# Altium project EIT_Teensybasedv1.PrjPcb (part 2 of 3)

## Sheet EIT_Teensy_Mux.SchDoc: EIT_Teensy
size A4 portrait
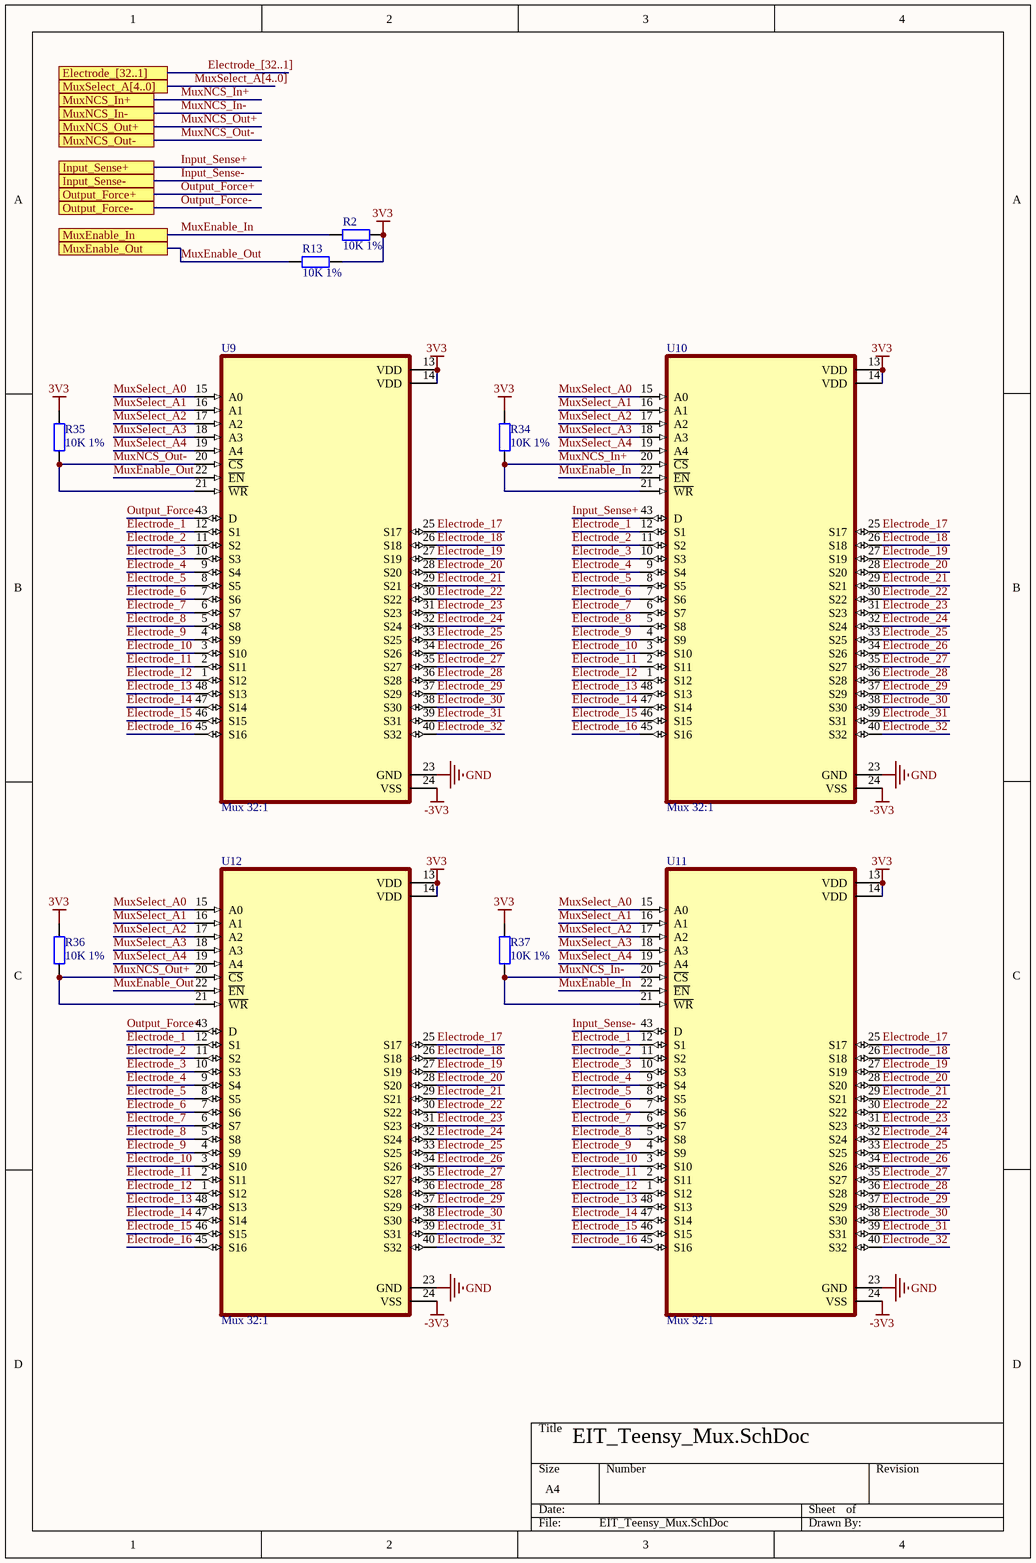
[diagram p4: EIT_Teensy_Mux.SchDoc]

### Parts
R2  10K 1%  [0603 RES]
R13  10K 1%  [0603 RES]
R34  10K 1%  [0603 RES]
R35  10K 1%  [0603 RES]
R36  10K 1%  [0603 RES]
R37  10K 1%  [0603 RES]
U9  Mux 32:1  [QFP50P900X900X120-49N]
U10  Mux 32:1  [QFP50P900X900X120-49N]
U11  Mux 32:1  [QFP50P900X900X120-49N]
U12  Mux 32:1  [QFP50P900X900X120-49N]

### Ports
Electrode_[32..1], Input_Sense+, Input_Sense-, MuxEnable_In, MuxEnable_Out, MuxNCS_In+, MuxNCS_In-, MuxNCS_Out+, MuxNCS_Out-, MuxSelect_A[4..0], Output_Force+, Output_Force-

### Nets
3V3: R2.2 R13.2 R34.2 R35.2 R36.2 R37.2 U9.13(VDD) U9.14(VDD) U10.13(VDD) U10.14(VDD) U11.13(VDD) U11.14(VDD) U12.13(VDD) U12.14(VDD)
-3V3: U9.24(VSS) U10.24(VSS) U11.24(VSS) U12.24(VSS)
GND: U9.23(GND) U10.23(GND) U11.23(GND) U12.23(GND)
Electrode_1: U9.12(S1) U10.12(S1) U11.12(S1) U12.12(S1)
Electrode_2: U9.11(S2) U10.11(S2) U11.11(S2) U12.11(S2)
Electrode_3: U9.10(S3) U10.10(S3) U11.10(S3) U12.10(S3)
Electrode_4: U9.9(S4) U10.9(S4) U11.9(S4) U12.9(S4)
Electrode_5: U9.8(S5) U10.8(S5) U11.8(S5) U12.8(S5)
Electrode_6: U9.7(S6) U10.7(S6) U11.7(S6) U12.7(S6)
Electrode_7: U9.6(S7) U10.6(S7) U11.6(S7) U12.6(S7)
Electrode_8: U9.5(S8) U10.5(S8) U11.5(S8) U12.5(S8)
Electrode_9: U9.4(S9) U10.4(S9) U11.4(S9) U12.4(S9)
Electrode_10: U9.3(S10) U10.3(S10) U11.3(S10) U12.3(S10)
Electrode_11: U9.2(S11) U10.2(S11) U11.2(S11) U12.2(S11)
Electrode_12: U9.1(S12) U10.1(S12) U11.1(S12) U12.1(S12)
Electrode_13: U9.48(S13) U10.48(S13) U11.48(S13) U12.48(S13)
Electrode_14: U9.47(S14) U10.47(S14) U11.47(S14) U12.47(S14)
Electrode_15: U9.46(S15) U10.46(S15) U11.46(S15) U12.46(S15)
Electrode_16: U9.45(S16) U10.45(S16) U11.45(S16) U12.45(S16)
Electrode_17: U9.25(S17) U10.25(S17) U11.25(S17) U12.25(S17)
Electrode_18: U9.26(S18) U10.26(S18) U11.26(S18) U12.26(S18)
Electrode_19: U9.27(S19) U10.27(S19) U11.27(S19) U12.27(S19)
Electrode_20: U9.28(S20) U10.28(S20) U11.28(S20) U12.28(S20)
Electrode_21: U9.29(S21) U10.29(S21) U11.29(S21) U12.29(S21)
Electrode_22: U9.30(S22) U10.30(S22) U11.30(S22) U12.30(S22)
Electrode_23: U9.31(S23) U10.31(S23) U11.31(S23) U12.31(S23)
Electrode_24: U9.32(S24) U10.32(S24) U11.32(S24) U12.32(S24)
Electrode_25: U9.33(S25) U10.33(S25) U11.33(S25) U12.33(S25)
Electrode_26: U9.34(S26) U10.34(S26) U11.34(S26) U12.34(S26)
Electrode_27: U9.35(S27) U10.35(S27) U11.35(S27) U12.35(S27)
Electrode_28: U9.36(S28) U10.36(S28) U11.36(S28) U12.36(S28)
Electrode_29: U9.37(S29) U10.37(S29) U11.37(S29) U12.37(S29)
Electrode_30: U9.38(S30) U10.38(S30) U11.38(S30) U12.38(S30)
Electrode_31: U9.39(S31) U10.39(S31) U11.39(S31) U12.39(S31)
Electrode_32: U9.40(S32) U10.40(S32) U11.40(S32) U12.40(S32)
Input_Sense+: U10.43(D) ; port Input_Sense+
Input_Sense-: U11.43(D) ; port Input_Sense-
MuxEnable_In: R2.1 U10.22(~{EN}) U11.22(~{EN}) ; port MuxEnable_In
MuxEnable_Out: R13.1 U9.22(~{EN}) U12.22(~{EN}) ; port MuxEnable_Out
MuxNCS_In+: R34.1 U10.20(~{CS}) U10.21(~{WR}) ; port MuxNCS_In+
MuxNCS_In-: R37.1 U11.20(~{CS}) U11.21(~{WR}) ; port MuxNCS_In-
MuxNCS_Out+: R36.1 U12.20(~{CS}) U12.21(~{WR}) ; port MuxNCS_Out+
MuxNCS_Out-: R35.1 U9.20(~{CS}) U9.21(~{WR}) ; port MuxNCS_Out-
MuxSelect_A0: U9.15(A0) U10.15(A0) U11.15(A0) U12.15(A0)
MuxSelect_A1: U9.16(A1) U10.16(A1) U11.16(A1) U12.16(A1)
MuxSelect_A2: U9.17(A2) U10.17(A2) U11.17(A2) U12.17(A2)
MuxSelect_A3: U9.18(A3) U10.18(A3) U11.18(A3) U12.18(A3)
MuxSelect_A4: U9.19(A4) U10.19(A4) U11.19(A4) U12.19(A4)
Output_Force+: U12.43(D) ; port Output_Force+
Output_Force-: U9.43(D) ; port Output_Force-

### Buses and harness runs
bus Electrode_[32..1] = port Electrode_[32..1]
bus MuxSelect_A[4..0] = port MuxSelect_A[4..0]

### Library data of the parts
R2 R13 R34-R37 = Res 0603 10K 1%: Res General Purpose Thick Film 0603 10K Ohm 1% 1/10W ±100ppm/°C Molded SMD Paper T/R; Manufacturer: Yageo; Manufacturer Part Number: RC0603FR-0710KL; Voltage Rating: 75V; Resistance: 10kR; Power Rating: 100mW; Voltage Rating (DC): 50V; Supplier 1: Digi-Key; RoHS: Yes; Category: Chip SMD Resistors; Stock 1: 18430741; Pricing 1: 1=0.10000, 10=0.02400, 100=0.00970, 1000=0.00436, 2500=0.00378 (USD); Case/Package: 0603; Number of Pins: 2; Case Code (Imperial): 0603; Case Code (Metric): 1608; Size Code: 0603; Weight: 7.1E-05oz; Min Operating Temperature: -55°C; Max Operating Temperature: 155°C; Packaging: Tape and Reel; Tolerance: 1%; Termination: SMD/SMT; Resistor Type: Thick Film; Temperature Coefficient: 100ppm/°C; Features: Moisture Resistant; Series: RC; Max Power Dissipation: 100mW; Number of Terminations: 2; Resistance Tolerance: 1%; Construction: Rectangular; Length: 1.6mm; Width: 0.8mm; Height: 0.45mm; Depth: 0.8mm; Lead Pitch: 0.3mm; REACH SVHC: Unknown; Military Standard: Not; Lead Free: Lead Free; RoHS Compliant: Yes; ComponentLink1URL: https://datasheet.ciiva.com/15189/getdatasheetpartid-409289-15189591.pdf?src-supplier=Verical; ComponentLink1Description: https://datasheet.ciiva.com/15189/getdatasheetpartid-409289-15189591.pdf?src-supplier=Verical; ComponentLink2URL: https://datasheet.ciiva.com/7660/38590-7660789.pdf?src-supplier=Element14; ComponentLink2Description: https://datasheet.ciiva.com/7660/38590-7660789.pdf?src-supplier=Element14; ComponentLink3URL: https://datasheet.ciiva.com/7746/1738695-7746239.pdf?src-supplier=Element14; ComponentLink3Description: https://datasheet.ciiva.com/7746/1738695-7746239.pdf?src-supplier=Element14; ComponentLink4URL: https://datasheet.ciiva.com/7983/443971-7983596.pdf?src-supplier=Element14; ComponentLink4Description: https://datasheet.ciiva.com/7983/443971-7983596.pdf?src-supplier=Element14; ComponentLink5URL: https://datasheet.ciiva.com/22747/443971-22747519.pdf?src-supplier=Element14; ComponentLink5Description: https://datasheet.ciiva.com/22747/443971-22747519.pdf?src-supplier=Element14; ComponentLink6URL: https://datasheet.ciiva.com/46440/1868787-46440891.pdf?src-supplier=Element14; ComponentLink6Description: https://datasheet.ciiva.com/46440/1868787-46440891.pdf?src-supplier=Element14; Supplier Part Number 1: 311-10.0KHRCT-ND
U9-U12 = Mux ADG732BSUZ: Analog Multiplexer Single 32:1 48-Pin TQFP T/R; Manufacturer: Analog Devices; Manufacturer Part Number: ADG732BSUZ-REEL; Min Supply Voltage: 1.8V; Max Supply Voltage: 5.5V; Number of Inputs: 32; Number of Outputs: 1; Operating Supply Voltage: 5V; Dual Supply Voltage: 2.5V; Bandwidth: 18MHz; Max Power Dissipation: 100uW; On-State Resistance: 5.5R; Operating Supply Current: 10uA; Turn-Off Delay Time: 16ns; Supply Type: Single,Dual; Interface: Parallel; Supplier 1: Digi-Key; RoHS: Yes; Category: Interface ICs; Stock 1: 3425; Pricing 1: 1=12.59000, 10=11.37200, 25=10.84320, 100=9.41510, 250=8.99200, 500=8.19856, 1000=7.48500 (USD); Case/Package: TQFP; Number of Pins: 48; Min Operating Temperature: -40°C; Max Operating Temperature: 85°C; Number of Channels: 32; Package Quantity: 2000; Packaging: Tape and Reel; Number of Circuits: 1; -3db Bandwidth: 18MHz; Logic Function: Multiplexer; Series: -; Lead Free: Contains Lead; RoHS Compliant: Yes; ComponentLink1URL: https://datasheet.ciiva.com/26824/adg732bsuz-reel-26824926.pdf?src-supplier=IIIC; ComponentLink1Description: https://datasheet.ciiva.com/26824/adg732bsuz-reel-26824926.pdf?src-supplier=IIIC; ComponentLink2URL: https://datasheet.ciiva.com/16637/adg726-732-16637530.pdf?src-supplier=Avnet+Europe; ComponentLink2Description: https://datasheet.ciiva.com/16637/adg726-732-16637530.pdf?src-supplier=Avnet+Europe; Supplier Part Number 1: ADG732BSUZ-REELCT-ND

## Sheet EIT_Teensy_PSU.SchDoc: EIT_Teensy
size A4
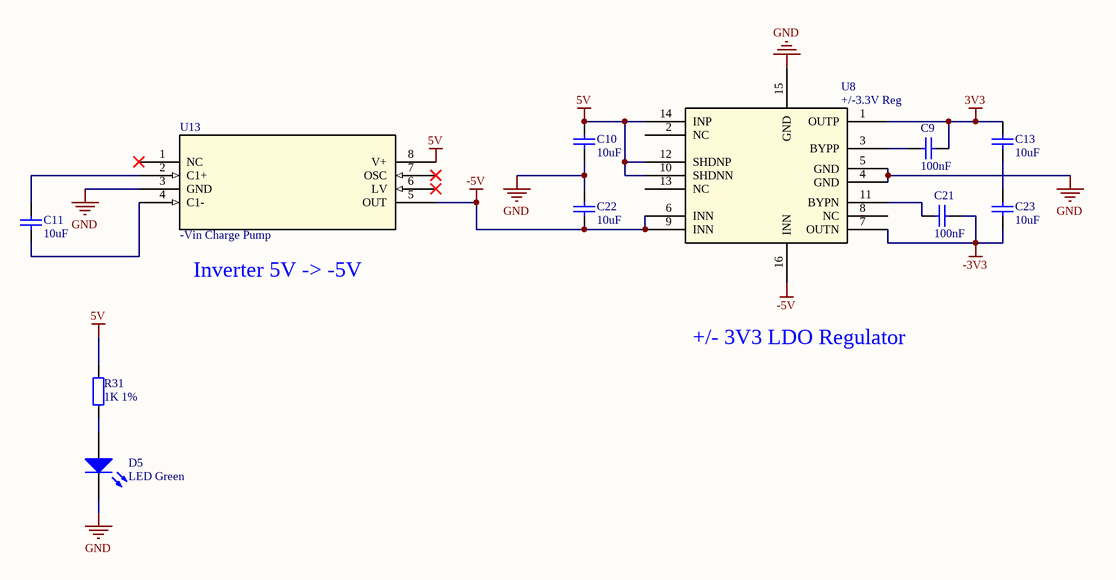
[diagram p5: EIT_Teensy_PSU.SchDoc]

### Parts
C9  100nF  [0603 CAP]
C10  10uF  [0603 CAP]
C11  10uF  [0603 CAP]
C13  10uF  [0603 CAP]
C21  100nF  [0603 CAP]
C22  10uF  [0603 CAP]
C23  10uF  [0603 CAP]
D5  LED Green  [0603 LED]
R31  1K 1%  [0603 RES]
U8  +/-3.3V Reg  [14-DFN]
U13  -Vin Charge Pump  [8-SOIC]

### Nets
3V3: C9.2 C13.2 U8.1(OUTP)
5V: C10.2 R31.1 U8.10(SHDNN) U8.12(SHDNP) U8.14(INP) U13.8(V+)
-3V3: C21.2 C23.1 U8.7(OUTN)
-5V: C22.1 U8.6(INN) U8.9(INN) U8.16(INN) U13.5(OUT)
GND: C10.1 C22.2 D5.2(K) U8.4(GND) U8.5(GND) U8.15(GND) U13.3(GND)
NetC9_1: C9.1 U8.3(BYPP)
NetC11_1: C11.1 U13.4(C1-)
NetC11_2: C11.2 U13.2(C1+)
NetC13_1: C13.1 C23.2
NetC21_1: C21.1 U8.11(BYPN)
NetD5_1: D5.1(A) R31.2

Not connected (* = marked no-connect by the designer): U8 2(NC) 8(NC) 13(NC); U13 1(NC)* 6(LV)* 7(OSC)*

### Notes on the sheet
- Inverter 5V -> -5V
- +/- 3V3 LDO Regulator

### Library data of the parts
C9 C21 = Cap 0603 100nF 10% 50V: Multi Layer Ceramic Capacitor (MLCC) / Cap Ceramic 0.1uF 50V X7R 10% Pad SMD 0603 125¡ãC T/R; Manufacturer: Samsung; Manufacturer Part Number: CL10B104KB8NNNC; Supplier 1: Digi-Key; RoHS: Yes; Category: Ceramic Capacitors; Stock 1: 16768569; Pricing 1: 1=0.10000, 10=0.03000, 50=0.01620, 100=0.01330, 500=0.00950, 1000=0.00746 (USD); Mount: Surface Mount; Case/Package: 0603; Case Code (Metric): 1608; Case Code (Imperial): 0603; Material: Ceramic; Contact Plating: Tin; Min Operating Temperature: -55°C; Max Operating Temperature: 125°C; Tolerance: 10%; Package Quantity: 1; Packaging: Tape and Reel; Capacitance: 100nF; Dielectric: X7R; Series: CL; Voltage Rating: 50V; Voltage: 50V; Voltage Rating (DC): 50V; Construction: Flat; Length: 1.6mm; Width: 0.031inch; Height: 0.8mm; Depth: 0.8mm; Thickness: 0.035inch; Radiation Hardening: No; Lead Free: Lead Free; RoHS Compliant: Yes; ComponentLink1URL: https://datasheet.ciiva.com/25803/cl10b104kb8nnnc-25803393.pdf?src-supplier=Digi-Key; ComponentLink1Description: https://datasheet.ciiva.com/25803/cl10b104kb8nnnc-25803393.pdf?src-supplier=Digi-Key; ComponentLink2URL: https://datasheet.ciiva.com/26838/getdatasheetpartid-89097-26838411.pdf?src-supplier=Verical; ComponentLink2Description: https://datasheet.ciiva.com/26838/getdatasheetpartid-89097-26838411.pdf?src-supplier=Verical; ComponentLink3URL: https://datasheet.ciiva.com/29198/456651-da-01-en-vs-kondensator-0605-29198839.pdf?src-supplier=Conrad; ComponentLink3Description: https://datasheet.ciiva.com/29198/456651-da-01-en-vs-kondensator-0605-29198839.pdf?src-supplier=Conrad; Supplier Part Number 1: 1276-1000-1-ND
C10 C11 C13 C22 C23 = Cap 0603 10uF 10% 25V: 0603 10 uF 25 V ±20 % Tolerance X5R Surface Mount Multilayer Ceramic Capacitor; Manufacturer: Murata; Manufacturer Part Number: GRT188R61E106ME13D; Voltage Rating: 25V; Tolerance: 20%; Supplier 1: Digi-Key; RoHS: No; Category: Ceramic Capacitors; Stock 1: 290939; Pricing 1: 1=0.53000, 10=0.36700, 50=0.25660, 100=0.22000, 500=0.16498, 1000=0.13932 (USD); Case/Package: 0603; RoHS Compliant: No; ComponentLink1URL: https://search.murata.co.jp/Ceramy/image/img/A01X/G101/ENG/GRT188R61E106ME13-01.pdf?src-supplier=Digi-Key; ComponentLink1Description: https://search.murata.co.jp/Ceramy/image/img/A01X/G101/ENG/GRT188R61E106ME13-01.pdf?src-supplier=Digi-Key; Supplier Part Number 1: 490-12323-1-ND; Mount: Surface Mount; Case Code (Metric): 1608; Case Code (Imperial): 0603; Min Operating Temperature: -55°C; Max Operating Temperature: 85°C; Packaging: Tape and Reel; Capacitance: 10uF; Length: 0.063inch; Width: 0.031inch; Thickness: 0.035inch; Ratings: AEC-Q200; ComponentLink2URL: http://search.murata.co.jp/Ceramy/image/img/A01X/G101/ENG/GRT188R61E106ME13-01.pdf?src-supplier=Digi-Key; ComponentLink2Description: http://search.murata.co.jp/Ceramy/image/img/A01X/G101/ENG/GRT188R61E106ME13-01.pdf?src-supplier=Digi-Key
D5 = LED Green 0603 2V: LED GREEN DIFFUSED 0603 SMD; Manufacturer: Osram Opto; Manufacturer Part Number: LG Q396-PS-35; Lens Color: White; Luminous Intensity: 163mcd; Test Current: 20mA; Viewing Angle: 120°; Dominant Wavelength: 573nm; Forward Voltage: 2V; Lens Style: Flat,Rectangular; Lens Size: 0.8mm; Supplier 1: Digi-Key; RoHS: Yes; Stock 1: 58559; Pricing 1: 1=0.38000, 10=0.20600, 100=0.09540, 500=0.08808, 1000=0.06900, 2000=0.06754 (USD); Mount: Surface Mount; Case/Package: 0603; Color: Green; Case Code (Imperial): 0603; Case Code (Metric): 1608; Packaging: Tape and Reel; Lens Transparency: Diffused; Forward Current: 20mA; Wavelength: 573nm; Length: 1.6mm; Width: 0.8mm; Height: 0.4mm; RoHS Compliant: Yes; REACH SVHC: No SVHC; ComponentLink1URL: http://www.farnell.com/datasheets/2057314.pdf?src-supplier=Farnell; ComponentLink1Description: http://www.farnell.com/datasheets/2057314.pdf?src-supplier=Farnell; ComponentLink2URL: https://dammedia.osram.info/media/resource/hires/osram-dam-2493948/LG%20Q396.pdf?src-supplier=Digi-Key; ComponentLink2Description: https://dammedia.osram.info/media/resource/hires/osram-dam-2493948/LG%20Q396.pdf?src-supplier=Digi-Key; ComponentLink3URL: http://www.osram-os.com/Graphics/XPic6/00153197_0.pdf?src-supplier=Digi-Key; ComponentLink3Description: http://www.osram-os.com/Graphics/XPic6/00153197_0.pdf?src-supplier=Digi-Key; ComponentLink4URL: http://www.farnell.com/datasheets/2057314.pdf?src-supplier=Element14; ComponentLink4Description: http://www.farnell.com/datasheets/2057314.pdf?src-supplier=Element14; ComponentLink5URL: http://www.farnell.com/datasheets/2057314.pdf?src-supplier=Newark; ComponentLink5Description: http://www.farnell.com/datasheets/2057314.pdf?src-supplier=Newark; Supplier Part Number 1: 475-3754-1-ND
R31 = Res 0603 1K 1%: RES SMD 1K OHM 1% 1/10W 0603; Manufacturer: Yageo; Manufacturer Part Number: RC0603FR-071KL; Power Rating: 100mW; Resistance: 1kR; Voltage Rating: 50V; Temperature Coefficient: 100ppm/°C; Supplier 1: Digi-Key; RoHS: Yes; Category: Chip SMD Resistors; Stock 1: 23578085; Pricing 1: 1=0.10000, 10=0.02400, 100=0.00970, 1000=0.00436, 2500=0.00378 (USD); Case/Package: 0603; Case Code (Imperial): 0603; Case Code (Metric): 1608; Size Code: 0603; Contact Plating: Tin,Matte; Min Operating Temperature: -55°C; Max Operating Temperature: 155°C; Tolerance: 1%; Packaging: Tape and Reel; Termination: SMD/SMT; Resistor Type: Thick Film; Features: Moisture Resistant; Series: RC; Max Power Dissipation: 100mW; Number of Terminations: 2; Resistance Tolerance: 1%; Construction: Rectangular; Technology: THICK FILM; Length: 1.6mm; Height: 0.45mm; Depth: 0.8mm; Radiation Hardening: No; REACH SVHC: No SVHC; Military Standard: Not; Lead Free: Lead Free; RoHS Compliant: Yes; ComponentLink1URL: https://datasheet.ciiva.com/8896/pyu-rc0603-51-rohs-l-4-8896106.pdf?src-supplier=Avnet; ComponentLink1Description: https://datasheet.ciiva.com/8896/pyu-rc0603-51-rohs-l-4-8896106.pdf?src-supplier=Avnet; Supplier Part Number 1: 311-1.00KHRCT-ND
U8 = IC Reg LDO +/-3.3V 150mA: IC REG LINEAR +-3.3V 14DFN; Manufacturer: Analog Devices / Linear Technology; Manufacturer Part Number: LT3032EDE-3.3#PBF; Output Current: 150mA; Dropout Voltage: 270mV; Number of Regulators: 2; Min Current Limit: 170mA; Output Voltage: 3.3V; Supplier 1: Digi-Key; RoHS: Yes; Category: Voltage Regulators - Linear; Stock 1: 2734; Pricing 1: 1=5.87000, 10=5.27300, 25=4.98480, 100=4.32000, 250=4.09848, 500=3.67756, 1000=3.13500 (USD); Mount: Surface Mount; Case/Package: DFN; Number of Pins: 14; Min Operating Temperature: -40°C; Max Operating Temperature: 125°C; Packaging: Rail/Tube; Number of Outputs: 2; REACH SVHC: No SVHC; RoHS Compliant: Yes; ComponentLink1URL: http://farnell.com//datasheets/2281794.pdf?src-supplier=Farnell; ComponentLink1Description: http://farnell.com//datasheets/2281794.pdf?src-supplier=Farnell; ComponentLink2URL: http://www.linear.com/docs/44087?src-supplier=Digi-Key; ComponentLink2Description: http://www.linear.com/docs/44087?src-supplier=Digi-Key; Supplier Part Number 1: LT3032EDE-3.3#PBF-ND
U13 = LMC7660IMX/NOPB: Charge Pump -Vin -10V 8-Pin SOIC T/R; Manufacturer: TI National Semiconductor; Max Input Voltage: 10V; Min Input Voltage: 1.5V; Number of Outputs: 1; Switching Frequency: 10kHz; Operating Supply Current: 200uA; Max Output Voltage: -1.5V; Logic Function: Inverting; Output Power: 600mW; Quiescent Current: 120uA; Output Current: 20uA; Output Type: Adjustable; Supplier 1: Digi-Key; Manufacturer Part Number: LMC7660IMX/NOPB; RoHS: Yes; Category: Voltage Regulators - Switching; Stock 1: 20127; Pricing 1: 1=0.87000, 10=0.78200, 25=0.74200, 100=0.56980, 250=0.50352, 500=0.47700, 1000=0.37100 (USD); Mount: Surface Mount; Case/Package: SOIC N; Number of Pins: 8; Weight: 0.006596oz; Contact Plating: Tin; Min Operating Temperature: -40°C; Max Operating Temperature: 85°C; Output Voltage: -10V; Packaging: Tape and Reel; Min Supply Voltage: 1.5V; Max Supply Voltage: 10V; Min Output Voltage: -10V; Radiation Hardening: No; REACH SVHC: No SVHC; Lead Free: Lead Free; RoHS Compliant: Yes; ComponentLink1URL: https://datasheet.ciiva.com/6598/lmc7660-6598421.pdf?src-supplier=Digi-Key; ComponentLink1Description: https://datasheet.ciiva.com/6598/lmc7660-6598421.pdf?src-supplier=Digi-Key; ComponentLink2URL: https://datasheet.ciiva.com/6598/lmc7660-6598422.pdf?src-supplier=Digi-Key; ComponentLink2Description: https://datasheet.ciiva.com/6598/lmc7660-6598422.pdf?src-supplier=Digi-Key; ComponentLink3URL: https://datasheet.ciiva.com/6598/lmc7660-6598423.pdf?src-supplier=Digi-Key; ComponentLink3Description: https://datasheet.ciiva.com/6598/lmc7660-6598423.pdf?src-supplier=Digi-Key; ComponentLink4URL: https://datasheet.ciiva.com/46433/1841924-46433674.pdf?src-supplier=Element14; ComponentLink4Description: https://datasheet.ciiva.com/46433/1841924-46433674.pdf?src-supplier=Element14; Supplier Part Number 1: LMC7660IMX/NOPBCT-ND

## Sheet EIT_Teensy_VCCS.SchDoc: EIT_Teensy
size A3
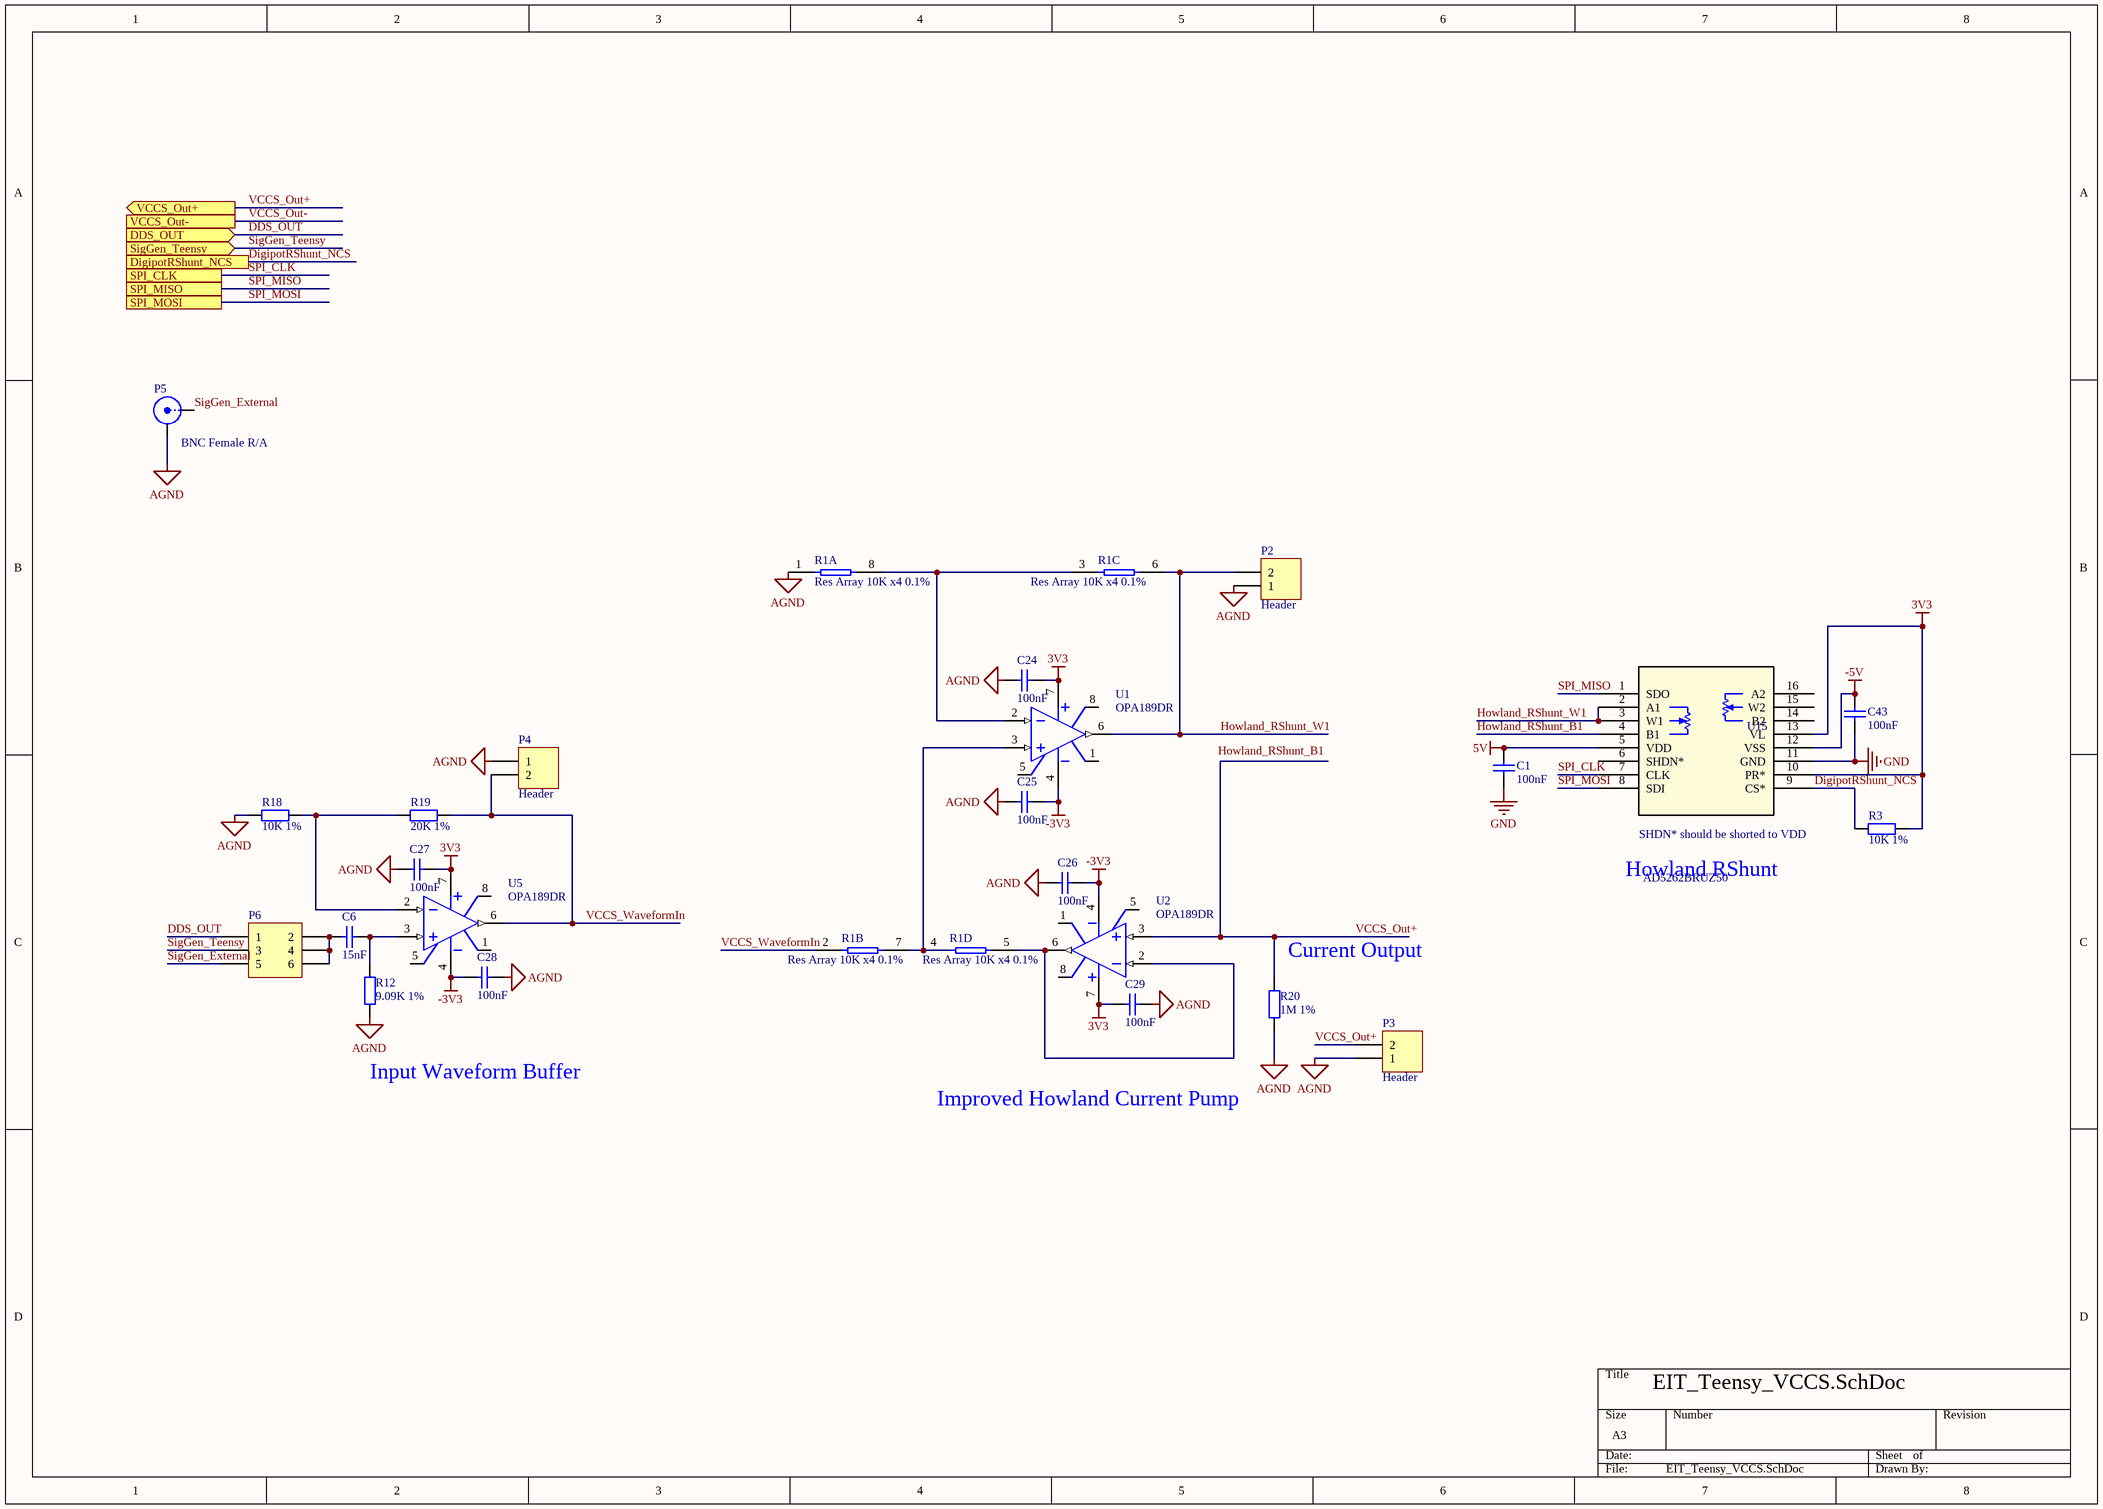
[diagram p6: EIT_Teensy_VCCS.SchDoc]

### Parts
C1  100nF  [0603 CAP]
C6  15nF  [0603 CAP]
C24  100nF  [0603 CAP]
C25  100nF  [0603 CAP]
C26  100nF  [0603 CAP]
C27  100nF  [0603 CAP]
C28  100nF  [0603 CAP]
C29  100nF  [0603 CAP]
C43  100nF  [0603 CAP]
P2  Header  [HEADER 2.54MM 2X1 MALE]
P3  Header  [HEADER 2.54MM 2X1 MALE]
P4  Header  [HEADER 2.54MM 2X1 MALE]
P5  BNC Female R/A  [BNC_RA CON]
P6  Header 3X2  [HDR2X3 Male 2.54mm]  (value not drawn)
R1  Res Array 10K x4 0.1%  [8-SOIC]  (parts A,B,C,D of 4)
R3  10K 1%  [0603 RES]
R12  9.09K 1%  [0603 RES]
R18  10K 1%  [0603 RES]
R19  20K 1%  [0603 RES]
R20  1M 1%  [0603 RES]
U1  OPA189DR  [8-SOIC]
U2  OPA189DR  [8-SOIC]
U5  OPA189DR  [8-SOIC]
U15  AD5262BRUZ50

### Ports
DDS_OUT (in), DigipotRShunt_NCS, SigGen_Teensy (in), SPI_CLK, SPI_MISO, SPI_MOSI, VCCS_Out+ (out), VCCS_Out-

### Nets
3V3: C24.2 C27.2 C29.2 R3.1 U1.7(V+) U2.7(V+) U5.7(V+) U15.10(PR*) U15.13(VL)
5V: C1.2 U15.5(VDD)
-3V3: C25.2 C26.2 C28.1 U1.4(V-) U2.4(V-) U5.4(V-)
-5V: C43.2 U15.12(VSS)
AGND: C24.1 C25.1 C26.1 C27.1 C28.2 C29.1 P2.1 P3.1 P4.1 P5.2(Y) R1.1 R12.1 R18.1 R20.2
GND: C1.1 C43.1 U15.11(GND)
DDS_OUT: P6.1 ; port DDS_OUT
DigipotRShunt_NCS: R3.2 U15.9(CS*) ; port DigipotRShunt_NCS
Howland_RShunt_B1: U15.4(B1)
Howland_RShunt_W1: P2.2 R1.6 U1.6(OUT) U15.2(A1) U15.3(W1)
SigGen_External: P5.1(X) P6.5
SigGen_Teensy: P6.3 ; port SigGen_Teensy
SPI_CLK: U15.7(CLK) ; port SPI_CLK
SPI_MISO: U15.1(SDO) ; port SPI_MISO
SPI_MOSI: U15.8(SDI) ; port SPI_MOSI
VCCS_Out+: P3.2 R20.1 U2.3(IN+) ; port VCCS_Out+
VCCS_WaveformIn: P4.2 R1.2 R19.2 U5.6(OUT)
NetC6_1: C6.1 P6.2 P6.4 P6.6
NetC6_2: C6.2 R12.2 U5.3(IN+)
NetR1_3: R1.3 R1.8 U1.2(IN-)
NetR1_4: R1.4 R1.7 U1.3(IN+)
NetR1_5: R1.5 U2.2(IN-) U2.6(OUT)
NetR18_2: R18.2 R19.1 U5.2(IN-)

Not connected (* = marked no-connect by the designer): U1 1(OS_NUL) 5(OS_NUL) 8(TAB); U2 1(OS_NUL) 5(OS_NUL) 8(TAB); U5 1(OS_NUL) 5(OS_NUL) 8(TAB); U15 6(SHDN*) 14(B2) 15(W2) 16(A2)

### Notes on the sheet
- SHDN* should be shorted to VDD
- Howland RShunt
- (near R20) Current Output
- Input Waveform Buffer
- Improved Howland Current Pump
- Labels drawn without touching a wire or pin: Howland_RShunt_B1

### Library data of the parts
C1 C24-C29 C43 = Cap 0603 100nF 10% 50V: as C9 on sheet EIT_Teensy_PSU; Supplier 1: Digi-Key; RoHS: Yes; Category: Ceramic Capacitors; Stock 1: 16768569; Pricing 1: 1=0.10000, 10=0.03000, 50=0.01620, 100=0.01330, 500=0.00950, 1000=0.00746 (USD); Mount: Surface Mount; Case/Package: 0603; Case Code (Metric): 1608; Case Code (Imperial): 0603; Material: Ceramic; Contact Plating: Tin; Min Operating Temperature: -55°C; Max Operating Temperature: 125°C; Tolerance: 10%; Package Quantity: 1; Packaging: Tape and Reel; Capacitance: 100nF; Dielectric: X7R; Series: CL; Voltage Rating: 50V; Voltage: 50V; Voltage Rating (DC): 50V; Construction: Flat; Length: 1.6mm; Width: 0.031inch; Height: 0.8mm; Depth: 0.8mm; Thickness: 0.035inch; Radiation Hardening: No; Lead Free: Lead Free; RoHS Compliant: Yes; ComponentLink1URL: https://datasheet.ciiva.com/25803/cl10b104kb8nnnc-25803393.pdf?src-supplier=Digi-Key; ComponentLink1Description: https://datasheet.ciiva.com/25803/cl10b104kb8nnnc-25803393.pdf?src-supplier=Digi-Key; ComponentLink2URL: https://datasheet.ciiva.com/26838/getdatasheetpartid-89097-26838411.pdf?src-supplier=Verical; ComponentLink2Description: https://datasheet.ciiva.com/26838/getdatasheetpartid-89097-26838411.pdf?src-supplier=Verical; ComponentLink3URL: https://datasheet.ciiva.com/29198/456651-da-01-en-vs-kondensator-0605-29198839.pdf?src-supplier=Conrad; ComponentLink3Description: https://datasheet.ciiva.com/29198/456651-da-01-en-vs-kondensator-0605-29198839.pdf?src-supplier=Conrad; Supplier Part Number 1: 1276-1000-1-ND
C6 = Cap 0603 15nF 10% 50V: Cap Ceramic 0.015uF 50V X7R 10% SMD 0603 125C T/R; Manufacturer: Yageo; Manufacturer Part Number: CC0603KRX7R9BB153; Insulation Resistance: 10GR; Dissipation Factor: 2.5%; Supplier 1: Digi-Key; RoHS: Yes; Category: Ceramic Capacitors; Stock 1: 123647; Pricing 1: 1=0.10000, 10=0.05200, 50=0.02840, 100=0.02330, 500=0.01662, 1000=0.01306 (USD); Mount: Surface Mount; Case/Package: 0603; Case Code (Metric): 1608; Case Code (Imperial): 0603; Min Operating Temperature: -55°C; Max Operating Temperature: 125°C; Tolerance: 10%; Package Quantity: 1; Packaging: Tape and Reel; Capacitance: 15nF; Dielectric: X7R; Series: CC; Voltage Rating: 50V; Length: 1.6mm; Width: 0.031inch; Height: 0.8mm; Depth: 0.8mm; Thickness: 0.035inch; Radiation Hardening: No; RoHS Compliant: Yes; ComponentLink1URL: https://datasheet.ciiva.com/26918/getdatasheetpartid-403585-26918319.pdf?src-supplier=Verical; ComponentLink1Description: https://datasheet.ciiva.com/26918/getdatasheetpartid-403585-26918319.pdf?src-supplier=Verical; ComponentLink2URL: https://datasheet.ciiva.com/176/mlccorderingcode-176402.pdf?src-supplier=Digi-Key; ComponentLink2Description: https://datasheet.ciiva.com/176/mlccorderingcode-176402.pdf?src-supplier=Digi-Key; Supplier Part Number 1: 311-1430-1-ND; Dielectric Material: Ceramic; Voltage Rating (DC): 50V; Termination: SMD/SMT; Resistor Type: Ceramic; Voltage: 50V; REACH SVHC: Unknown; Lead Free: Lead Free; Halogen Free: Halogen Free; ComponentLink3URL: https://datasheet.ciiva.com/11587/upy-gphc-x7r-6-3v-to-50v-8-11587221.pdf?src-supplier=Avnet; ComponentLink3Description: https://datasheet.ciiva.com/11587/upy-gphc-x7r-6-3v-to-50v-8-11587221.pdf?src-supplier=Avnet; ComponentLink4URL: https://datasheet.ciiva.com/176/mlccorderingcode-176400.pdf?src-supplier=Digi-Key; ComponentLink4Description: https://datasheet.ciiva.com/176/mlccorderingcode-176400.pdf?src-supplier=Digi-Key; ComponentLink5URL: https://datasheet.ciiva.com/176/mlccorderingcode-176401.pdf?src-supplier=Digi-Key; ComponentLink5Description: https://datasheet.ciiva.com/176/mlccorderingcode-176401.pdf?src-supplier=Digi-Key; ComponentLink6URL: https://datasheet.ciiva.com/17434/upy-gphc-x7r-6-3v-to-50v-8-17434649.pdf?src-supplier=Avnet+Europe; ComponentLink6Description: https://datasheet.ciiva.com/17434/upy-gphc-x7r-6-3v-to-50v-8-17434649.pdf?src-supplier=Avnet+Europe; ComponentLink7URL: https://datasheet.ciiva.com/7978/1489800-7978167.pdf?src-supplier=Element14; ComponentLink7Description: https://datasheet.ciiva.com/7978/1489800-7978167.pdf?src-supplier=Element14
P2-P4 = Header 2x1 2.54mm T/H Male: CONN HEADER VERT 2POS 2.54MM; Manufacturer: Sullins; Manufacturer Part Number: PRPC002SAAN-RC; Number of Positions: 2; Connector Type: Male Pin; Pitch: 0.1inch; Supplier 1: Digi-Key; RoHS: Yes; Category: Connectors; Stock 1: 34676; Pricing 1: 1=0.08000, 10=0.07300, 25=0.05400, 50=0.04640, 100=0.04490, 250=0.03872, 500=0.03716 (USD); Mount: Through Hole; Color: Black; Contact Plating: Gold; Package Quantity: 1; Number of Rows: 1; Termination: Solder; Packaging: Bulk; Contact Mating Length: 0.23inch; ComponentLink1URL: https://datasheet.ciiva.com/741/xrxczzzsxxn-rc-st-11635-b-741243.pdf?src-supplier=Digi-Key; ComponentLink1Description: https://datasheet.ciiva.com/741/xrxczzzsxxn-rc-st-11635-b-741243.pdf?src-supplier=Digi-Key; Supplier Part Number 1: S1011EC-02-ND
P5 = Jack BNC Female T/H R/A TE: Conn ZDC/BNC RCP 0Hz to 4GHz 50Ohm Solder RA Thru-Hole Gold Over Nickel Over Copper Individual; Manufacturer: TE Connectivity; Manufacturer Part Number: 1-1337543-0; Dielectric Material: PE; Impedance: 50R; Connector Type: BNC,Jack; Polarity: Normal; Number of Positions: 1; PCB Mount Retention: With; Sealable: No (Without); Connector System: Cable-to-Board; Operating Frequency: 0 to 4 GHz; Tail Length: 4.9mm; PCB Thickness: 0.13inch; Supplier 1: Digi-Key; RoHS: Yes; Category: RF / Coaxial Connectors; Stock 1: 4913; Pricing 1: 1=1.67000, 10=1.51800, 25=1.42520, 50=1.36300, 100=1.30110, 250=1.17716, 500=1.08424, 1000=0.92935 (USD); Contact Material: Brass; Contact Plating: Gold; Color: White; Plating: Nickel; Body Plating: Nickel; Insulation Material: Polyethylene; Housing Color: White; Min Operating Temperature: -67°C; Max Operating Temperature: 185°C; Packaging: Box; Gender: Female; Frequency: 4GHz; Package Quantity: 100; Fastening Type: Bayonet; Termination: Solder; Max Frequency: 4GHz; Orientation: Right Angle; Series: BNC; Length: 14.7mm; Depth: 34.9mm; Radiation Hardening: No; REACH SVHC: Unknown; RoHS Compliant: Yes; ComponentLink1URL: https://datasheet.ciiva.com/644/eng-cd-1337543-g-644734.pdf?src-supplier=Digi-Key; ComponentLink1Description: https://datasheet.ciiva.com/644/eng-cd-1337543-g-644734.pdf?src-supplier=Digi-Key; ComponentLink2URL: https://datasheet.ciiva.com/644/eng-cd-1337543-g-644734.pdf?src-supplier=Farnell; ComponentLink2Description: https://datasheet.ciiva.com/644/eng-cd-1337543-g-644734.pdf?src-supplier=Farnell; ComponentLink3URL: https://datasheet.ciiva.com/11763/0900766b805faaaa-11763772.pdf?src-supplier=RSComponents; ComponentLink3Description: https://datasheet.ciiva.com/11763/0900766b805faaaa-11763772.pdf?src-supplier=RSComponents; ComponentLink4URL: https://datasheet.ciiva.com/3133/eng-ds-6-1773448-5-zdc-rf-coax-50-75-ohm-1007-3133303.pdf?src-supplier=Avnet; ComponentLink4Description: https://datasheet.ciiva.com/3133/eng-ds-6-1773448-5-zdc-rf-coax-50-75-ohm-1007-3133303.pdf?src-supplier=Avnet; ComponentLink5URL: https://datasheet.ciiva.com/30238/eng-ds-6-1773448-5-zdc-rf-coax-50-75-ohm-1007-30238783.pdf?src-supplier=Onlinecomponents.com; ComponentLink5Description: https://datasheet.ciiva.com/30238/eng-ds-6-1773448-5-zdc-rf-coax-50-75-ohm-1007-30238783.pdf?src-supplier=Onlinecomponents.com; ComponentLink6URL: https://datasheet.ciiva.com/16653/eng-ds-6-1773448-5-zdc-rf-coax-50-75-ohm-1007-16653071.pdf?src-supplier=Avnet+Europe; ComponentLink6Description: https://datasheet.ciiva.com/16653/eng-ds-6-1773448-5-zdc-rf-coax-50-75-ohm-1007-16653071.pdf?src-supplier=Avnet+Europe; ComponentLink7URL: https://datasheet.ciiva.com/14567/70084602-14567445.pdf?src-supplier=Allied+Electronics; ComponentLink7Description: https://datasheet.ciiva.com/14567/70084602-14567445.pdf?src-supplier=Allied+Electronics; ComponentLink8URL: https://datasheet.ciiva.com/1115/580087-1115285.pdf?src-supplier=Element14; ComponentLink8Description: https://datasheet.ciiva.com/1115/580087-1115285.pdf?src-supplier=Element14; Supplier Part Number 1: A97553-ND
P6 = Header 3X2 2.54mm Male: Header, 3-Pin, Dual row
R1 = Res Array 10K x4 0.1%: Res Thin Film NET 10K Ohm 0.1% 0.4W ±25ppm/°C ISOL Molded Epoxy 8-Pin SOIC Gull Wing SMD Medical T/R; Manufacturer: Vishay Dale Thin Film; Manufacturer Part Number: ORNTA1002AT1; Number of Terminals/Pins: 8; Voltage Rating: 100V; Resistance: 10kR; Number of Elements: 4; Circuit Type: Isolated; Power Per Element: 100mW; Supplier 1: Digi-Key; RoHS: Yes; Category: Resistor Arrays; Stock 1: 44707; Pricing 1: 1=3.86000, 10=3.45000, 25=3.24320, 50=2.96700, 100=2.55300, 250=2.20800, 500=2.00100 (USD); Mount: Surface Mount; Case/Package: DIP; Number of Pins: 8; Min Operating Temperature: -55°C; Max Operating Temperature: 125°C; Tolerance: 0.1%; Packaging: Tape and Reel; Package Quantity: 1; Termination: SMD/SMT; Number of Resistors: 4; Temperature Coefficient: 25ppm/°C; Voltage Rating (DC): 100V; Series: ORN; Resistance Tolerance: 0.1%; Technology: THIN FILM; Length: 0.194inch; Width: 3.99mm; Height: 0.068inch; Lead Pitch: 1.27mm; Radiation Hardening: No; REACH SVHC: Unknown; RoHS Compliant: Yes; ComponentLink1URL: https://datasheet.ciiva.com/23596/1750005-23596168.pdf?src-supplier=Newark; ComponentLink1Description: https://datasheet.ciiva.com/23596/1750005-23596168.pdf?src-supplier=Newark; ComponentLink2URL: https://datasheet.ciiva.com/2691/orn-2691499.pdf?src-supplier=Digi-Key; ComponentLink2Description: https://datasheet.ciiva.com/2691/orn-2691499.pdf?src-supplier=Digi-Key; ComponentLink3URL: https://datasheet.ciiva.com/2691/orn-2691500.pdf?src-supplier=Digi-Key; ComponentLink3Description: https://datasheet.ciiva.com/2691/orn-2691500.pdf?src-supplier=Digi-Key; ComponentLink4URL: https://datasheet.ciiva.com/2691/orn-2691501.pdf?src-supplier=Digi-Key; ComponentLink4Description: https://datasheet.ciiva.com/2691/orn-2691501.pdf?src-supplier=Digi-Key; ComponentLink5URL: https://datasheet.ciiva.com/8352/orn-8352811.pdf?src-supplier=Avnet; ComponentLink5Description: https://datasheet.ciiva.com/8352/orn-8352811.pdf?src-supplier=Avnet; ComponentLink6URL: https://datasheet.ciiva.com/5036/orn-102377-5036262.pdf?src-supplier=Mouser; ComponentLink6Description: https://datasheet.ciiva.com/5036/orn-102377-5036262.pdf?src-supplier=Mouser; Supplier Part Number 1: ORNT-10KACT-ND
R3 R18 = Res 0603 10K 1%: as R2 on sheet EIT_Teensy_Mux; Supplier 1: Digi-Key; RoHS: Yes; Category: Chip SMD Resistors; Stock 1: 18430741; Pricing 1: 1=0.10000, 10=0.02400, 100=0.00970, 1000=0.00436, 2500=0.00378 (USD); Case/Package: 0603; Number of Pins: 2; Case Code (Imperial): 0603; Case Code (Metric): 1608; Size Code: 0603; Weight: 7.1E-05oz; Min Operating Temperature: -55°C; Max Operating Temperature: 155°C; Packaging: Tape and Reel; Tolerance: 1%; Termination: SMD/SMT; Resistor Type: Thick Film; Temperature Coefficient: 100ppm/°C; Features: Moisture Resistant; Series: RC; Max Power Dissipation: 100mW; Number of Terminations: 2; Resistance Tolerance: 1%; Construction: Rectangular; Length: 1.6mm; Width: 0.8mm; Height: 0.45mm; Depth: 0.8mm; Lead Pitch: 0.3mm; REACH SVHC: Unknown; Military Standard: Not; Lead Free: Lead Free; RoHS Compliant: Yes; ComponentLink1URL: https://datasheet.ciiva.com/15189/getdatasheetpartid-409289-15189591.pdf?src-supplier=Verical; ComponentLink1Description: https://datasheet.ciiva.com/15189/getdatasheetpartid-409289-15189591.pdf?src-supplier=Verical; ComponentLink2URL: https://datasheet.ciiva.com/7660/38590-7660789.pdf?src-supplier=Element14; ComponentLink2Description: https://datasheet.ciiva.com/7660/38590-7660789.pdf?src-supplier=Element14; ComponentLink3URL: https://datasheet.ciiva.com/7746/1738695-7746239.pdf?src-supplier=Element14; ComponentLink3Description: https://datasheet.ciiva.com/7746/1738695-7746239.pdf?src-supplier=Element14; ComponentLink4URL: https://datasheet.ciiva.com/7983/443971-7983596.pdf?src-supplier=Element14; ComponentLink4Description: https://datasheet.ciiva.com/7983/443971-7983596.pdf?src-supplier=Element14; ComponentLink5URL: https://datasheet.ciiva.com/22747/443971-22747519.pdf?src-supplier=Element14; ComponentLink5Description: https://datasheet.ciiva.com/22747/443971-22747519.pdf?src-supplier=Element14; ComponentLink6URL: https://datasheet.ciiva.com/46440/1868787-46440891.pdf?src-supplier=Element14; ComponentLink6Description: https://datasheet.ciiva.com/46440/1868787-46440891.pdf?src-supplier=Element14; Supplier Part Number 1: 311-10.0KHRCT-ND
R12 = Res 0603 9.09K 1%: Res Thick Film 0603 90.9K Ohm 1% 0.1W(1/10W) ±100ppm/C Epoxy SMD T/R; Manufacturer: Yageo; Manufacturer Part Number: RC0603FR-0790K9L; Power Rating: 100mW; Resistance: 90.9kR; Voltage Rating: 75V; Temperature Coefficient: 100ppm/°C; Voltage Rating (DC): 50V; Supplier 1: Digi-Key; RoHS: Yes; Category: Chip SMD Resistors; Stock 1: 655755; Pricing 1: 1=0.10000, 10=0.02400, 100=0.00970, 1000=0.00436, 2500=0.00378 (USD); Case/Package: 0603; Case Code (Imperial): 0603; Case Code (Metric): 1608; Size Code: 0603; Min Operating Temperature: -55°C; Max Operating Temperature: 155°C; Tolerance: 1%; Packaging: Tape and Reel; Termination: SMD/SMT; Resistor Type: Thick Film; Features: Moisture Resistant; Series: RC; Max Power Dissipation: 100mW; Number of Terminations: 2; Construction: Rectangular; Length: 1.6mm; Height: 0.45mm; Depth: 0.8mm; Military Standard: Not; Lead Free: Lead Free; RoHS Compliant: Yes; ComponentLink1URL: https://datasheet.ciiva.com/15189/getdatasheetpartid-325203-15189835.pdf?src-supplier=Verical; ComponentLink1Description: https://datasheet.ciiva.com/15189/getdatasheetpartid-325203-15189835.pdf?src-supplier=Verical; Supplier Part Number 1: 311-90.9KHRCT-ND; Weight: 7.1E-05oz; Width: 0.8mm
R19 = Res 0603 20K 1%: Res General Purpose Thick Film 0603 20K Ohm 1% 1/10W ±100ppm/°C Molded SMD Paper T/R; Manufacturer: Yageo; Manufacturer Part Number: RC0603FR-0720KL; Resistance: 20kR; Voltage Rating (DC): 50V; Power Rating: 100mW; Supplier 1: Digi-Key; RoHS: Yes; Category: Chip SMD Resistors; Stock 1: 2390662; Pricing 1: 1=0.10000, 10=0.02400, 100=0.00970, 1000=0.00436, 2500=0.00378 (USD); Case/Package: 0603; Case Code (Imperial): 0603; Case Code (Metric): 1608; Size Code: 0603; Min Operating Temperature: -55°C; Max Operating Temperature: 155°C; Tolerance: 1%; Packaging: Tape and Reel; Features: Moisture Resistant; Series: RC; Voltage Rating: 50V; Termination: SMD/SMT; Resistor Type: Thick Film; Temperature Coefficient: 100ppm/°C; Max Power Dissipation: 100mW; Number of Terminations: 2; Construction: Rectangular; Length: 0.063inch; Width: 0.031inch; Height: 0.022inch; Depth: 0.8mm; Lead Free: Lead Free; RoHS Compliant: Yes; Military Standard: Not; ComponentLink1URL: https://datasheet.ciiva.com/11808/0900766b80f96399-11808275.pdf?src-supplier=RSComponents; ComponentLink1Description: https://datasheet.ciiva.com/11808/0900766b80f96399-11808275.pdf?src-supplier=RSComponents; Supplier Part Number 1: 311-20.0KHRCT-ND; Number of Pins: 2; Package Quantity: 1; Resistance Tolerance: 1%; Technology: THICK FILM; REACH SVHC: No SVHC; ComponentLink2URL: https://datasheet.ciiva.com/2453/pyu-r-int-thick-7-2453910.pdf?src-supplier=Digi-Key; ComponentLink2Description: https://datasheet.ciiva.com/2453/pyu-r-int-thick-7-2453910.pdf?src-supplier=Digi-Key; ComponentLink3URL: https://datasheet.ciiva.com/2453/pyu-r-int-thick-7-2453911.pdf?src-supplier=Digi-Key; ComponentLink3Description: https://datasheet.ciiva.com/2453/pyu-r-int-thick-7-2453911.pdf?src-supplier=Digi-Key; ComponentLink4URL: https://datasheet.ciiva.com/2453/pyu-r-int-thick-7-2453912.pdf?src-supplier=Digi-Key; ComponentLink4Description: https://datasheet.ciiva.com/2453/pyu-r-int-thick-7-2453912.pdf?src-supplier=Digi-Key; ComponentLink5URL: https://datasheet.ciiva.com/22747/443971-22747525.pdf?src-supplier=Element14; ComponentLink5Description: https://datasheet.ciiva.com/22747/443971-22747525.pdf?src-supplier=Element14
R20 = Res 0603 1M 1%: Yageo RC Series Thick Film Surface Mount Resistor 0603 Case 1M 1% 0.1W 100ppm/C; Manufacturer Part Number: RC0603FR-071ML; Voltage Rating: 75V; Voltage Rating (DC): 50V; Resistance: 1MR; Power Rating: 100mW; Temperature Coefficient: 100ppm/°C; Application(s): HIGH RELIABILITY; Supplier 1: Digi-Key; Manufacturer: Yageo; RoHS: Yes; Category: Chip SMD Resistors; Stock 1: 4599128; Pricing 1: 1=0.10000, 10=0.02400, 100=0.00970, 1000=0.00436, 2500=0.00378 (USD); Case/Package: 0603; Number of Pins: 2; Case Code (Imperial): 0603; Case Code (Metric): 1608; Weight: 0.000847oz; Min Operating Temperature: -55°C; Max Operating Temperature: 155°C; Tolerance: 1%; Packaging: Cut Tape; Package Quantity: 5000; Termination: SMD/SMT; Resistor Type: Thick Film; Series: RC; Technology: THICK FILM; Type: General Purpose; Length: 1.6mm; Width: 0.8mm; Height: 0.45mm; Depth: 0.8mm; REACH SVHC: No SVHC; Military Standard: Not; Lead Free: Lead Free; RoHS Compliant: Yes; ComponentLink1URL: https://datasheet.ciiva.com/11819/0900766b80f96399-11819295.pdf?src-supplier=RSComponents; ComponentLink1Description: https://datasheet.ciiva.com/11819/0900766b80f96399-11819295.pdf?src-supplier=RSComponents; ComponentLink2URL: https://datasheet.ciiva.com/12555/rc0603-272842-12555388.pdf?src-supplier=Mouser; ComponentLink2Description: https://datasheet.ciiva.com/12555/rc0603-272842-12555388.pdf?src-supplier=Mouser; Supplier Part Number 1: 311-1.00MHRCT-ND
U1 U2 U5 = OpAmp OPA189DR: 36V ZERO DRIFT OP-AMP; Manufacturer: Texas Instruments; Manufacturer Part Number: OPA189IDR; Number of Channels: 1; Slew Rate: 20V/µs; Gain Bandwidth Product: 14MHz; Input Bias Current: 70pA; Input Offset Voltage (Vos): 0.4uV; Operating Supply Current: 1.3mA; Supplier 1: Digi-Key; RoHS: Yes; Category: Amplifiers - Op Amps, Buffer, Instrumentation; Stock 1: 9768; Pricing 1: 1=2.85000, 10=2.56500, 25=2.41960, 100=2.06140, 250=1.93556, 500=1.69362, 1000=1.52471 (USD); Mount: Surface Mount; Case/Package: SOIC; Number of Pins: 8; Min Operating Temperature: -40°C; Max Operating Temperature: 125°C; Packaging: Tape and Reel; Number of Circuits: 1; RoHS Compliant: Yes; ComponentLink1URL: http://www.ti.com/lit/ds/symlink/opa189.pdf?src-supplier=Digi-Key; ComponentLink1Description: http://www.ti.com/lit/ds/symlink/opa189.pdf?src-supplier=Digi-Key; Supplier Part Number 1: 296-48941-1-ND
U15 = AD5262BRUZ50: Digital Potentiometer, 2 Func, 50000ohm, 3-wire Serial Control Interface, 256 Positions, PDSO16; Manufacturer: Analog Devices; Number of Positions: 256; Package Body Material: Plastic; Bandwidth-Nom: 130Hz; Negative Supply Voltage-Nom: -5V; Channels: 2; Package Equivalence Code: TSSOP16,.25; Power Supplies: 5/15/+-5V; Resistance Law: Linear; Resistance Tolerance-Max: 30%; Resistor Terminal Voltage-Max: 5V; Temperature Coefficient-Nom: 35ppm/°C; Time @ Peak Reflow Temperature-Max (s): 30s; Total Resistance-Nom: 50kR; Qualification Status: Not Qualified; Manufacturer Part Number: AD5262BRUZ50; RoHS: Yes; Category: Digital Potentiometers; Case/Package: TSSOP; Min Operating Temperature: -40°C; Max Operating Temperature: 85°C; Length: 5mm; Width: 4.4mm; RoHS Compliant: Yes; ComponentLink1URL: https://datasheet.ciiva.com:443/pdfs/VipMasterIC/IC/ANDI/ANDIS19757/ANDIS19757-1.pdf?src-supplier=IHS+Markit; ComponentLink1Description: https://datasheet.ciiva.com:443/pdfs/VipMasterIC/IC/ANDI/ANDIS19757/ANDIS19757-1.pdf?src-supplier=IHS+Markit; ComponentLink2URL: https://datasheet.ciiva.com/3045/ad5260-5262-3045560.pdf?src-supplier=Avnet; ComponentLink2Description: https://datasheet.ciiva.com/3045/ad5260-5262-3045560.pdf?src-supplier=Avnet; ComponentLink3URL: https://datasheet.ciiva.com/1331/ad5260-5262-1331021.pdf?src-supplier=Digi-Key; ComponentLink3Description: https://datasheet.ciiva.com/1331/ad5260-5262-1331021.pdf?src-supplier=Digi-Key; Supplier: Digi-Key; Supplier Part Number: 505-AD5262BRUZ50-ND; Stock: 1452; Pricing: 1=6.18, 10=5.581, 25=5.3212, 100=4.6203, 250=4.41268, 500=4.02334, 1000=3.5042, 2500=3.37441 (USD); Pins: 16; Reach SVHC Compliant: Yes; Package Shape: Rectangular; Terminal Finish: Tin; JESD-609 Code: e3; Control Interface: 3-WIRE SERIAL; Converter Type: DIGITAL POTENTIOMETER; JESD-30 Code: R-PDSO-G16; Moisture Sensitivity Level: 1; Package Style: SMALL OUTLINE, THIN PROFILE, SHRINK PITCHMeter; Peak Reflow Temperature (Cel): 260°C; Resistor Terminal Voltage-Min: -5V; Nominal Supply Voltage: 5V; Surface Mount: Yes; Terminal Form: Gull Wing; Terminal Position: DUAL; Height - Seated (Max): 1.2mm; Terminal Pitch: 0.65mm; Temperature Grade: INDUSTRIAL; ComponentLink4URL: https://datasheet.ciiva.com/22652/686036-22652986.pdf?src-supplier=Element14; ComponentLink4Description: https://datasheet.ciiva.com/22652/686036-22652986.pdf?src-supplier=Element14